# EAGLE schematic Main (EAGLE 9.4.2)
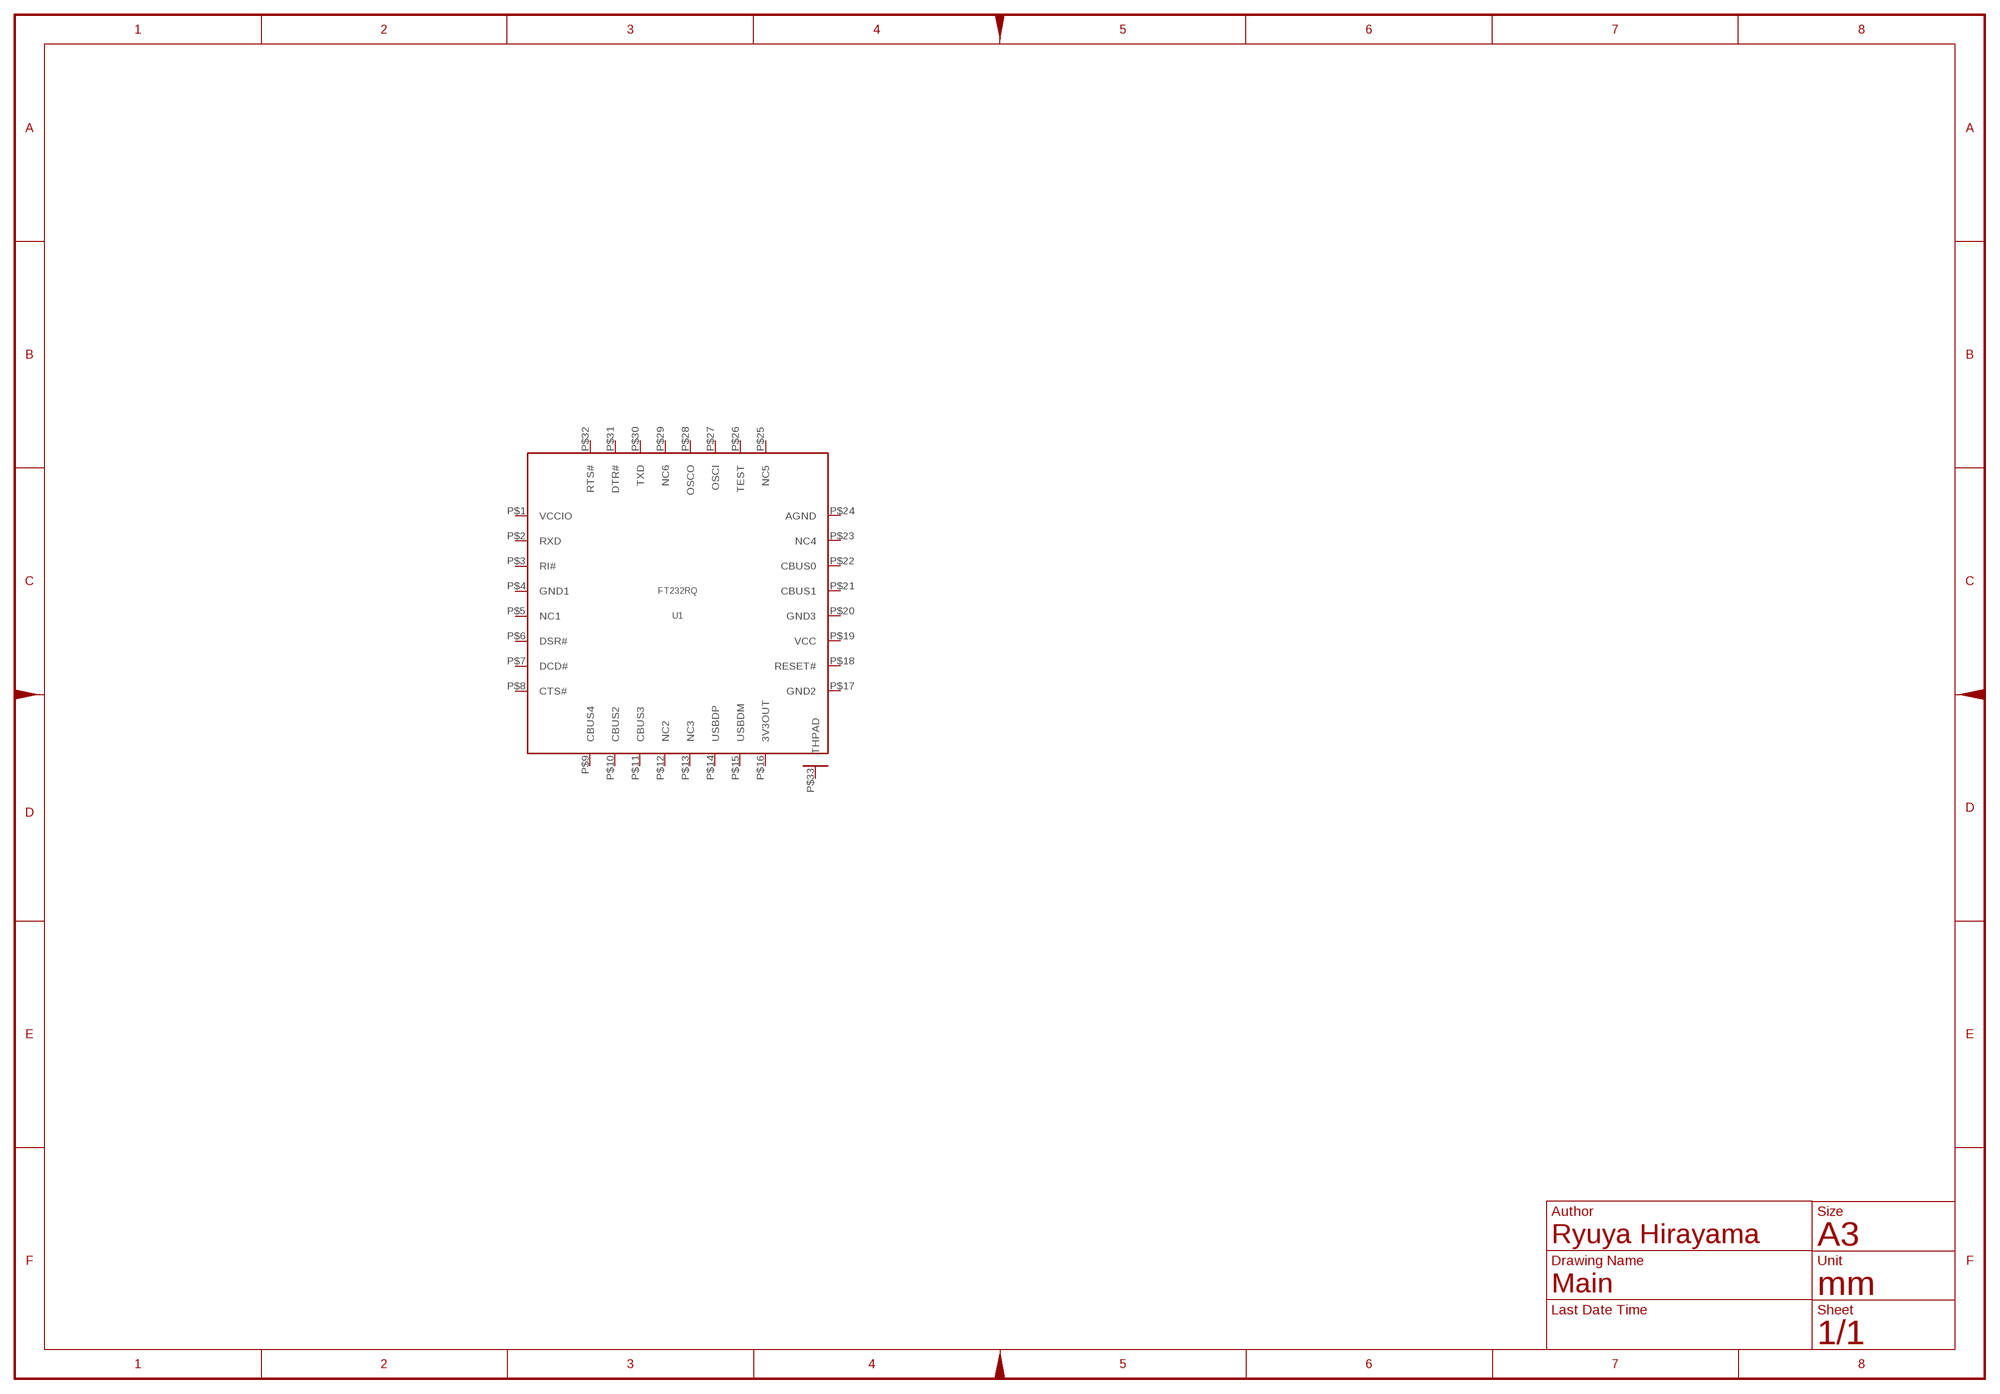
[diagram p0: schematic, sheet 1]

## Parts
U1  FT232RQ  [QFN-32]
Unconnected: U1.P$1(VCCIO) U1.P$2(RXD) U1.P$3(RI#) U1.P$4(GND1) U1.P$5(NC1) U1.P$6(DSR#) U1.P$7(DCD#) U1.P$8(CTS#) U1.P$9(CBUS4) U1.P$10(CBUS2) U1.P$11(CBUS3) U1.P$12(NC2) U1.P$13(NC3) U1.P$14(USBDP) U1.P$15(USBDM) U1.P$16(3V3OUT) U1.P$17(GND2) U1.P$18(RESET#) U1.P$19(VCC) U1.P$20(GND3) U1.P$21(CBUS1) U1.P$22(CBUS0) U1.P$23(NC4) U1.P$24(AGND) U1.P$25(NC5) U1.P$26(TEST) U1.P$27(OSCI) U1.P$28(OSCO) U1.P$29(NC6) U1.P$30(TXD) U1.P$31(DTR#) U1.P$32(RTS#) U1.P$33(THPAD)

## Library data of the parts
U1 = FT232:FT232RQ